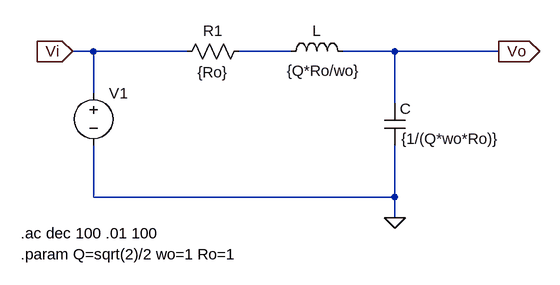
[diagram p0: schematic SOS_pasabajo_simple.asc]
SOS_pasabajo_simple.asc, the LTspice schematic file:
Version 4
SHEET 1 880 680
WIRE -224 112 -256 112
WIRE -80 112 -224 112
WIRE 80 112 0 112
WIRE 240 112 160 112
WIRE 400 112 240 112
WIRE -224 176 -224 112
WIRE 240 192 240 112
WIRE -224 336 -224 256
WIRE 240 336 240 256
WIRE 240 336 -224 336
WIRE 240 368 240 336
FLAG -256 112 Vi
IOPIN -256 112 In
FLAG 400 112 Vo
IOPIN 400 112 Out
FLAG 240 368 0
SYMBOL ind 64 128 R270
WINDOW 0 32 56 VTop 2
WINDOW 3 -29 66 VTop 2
SYMATTR InstName L
SYMATTR Value {Q*Ro/wo}
SYMBOL cap 224 192 R0
WINDOW 3 26 54 Left 2
SYMATTR Value {1/(Q*wo*Ro)}
SYMATTR InstName C
SYMBOL voltage -224 160 R0
WINDOW 3 24 96 Invisible 2
WINDOW 39 0 0 Left 0
SYMATTR Value SINE(0 1 0 0 0 0 1000)
SYMATTR InstName V1
SYMATTR Value2 AC 1 0
SYMBOL res 16 96 R90
WINDOW 0 0 56 VBottom 2
WINDOW 3 32 56 VTop 2
SYMATTR InstName R1
SYMATTR Value {Ro}
TEXT -336 392 Left 2 !.ac dec 100 .01 100
TEXT -336 424 Left 2 !.param Q=sqrt(2)/2 wo=1 Ro=1

The netlist it stands for:
* SOS_pasabajo_simple.asc
L N001 Vo {Q*Ro/wo}
C Vo 0 {1/(Q*wo*Ro)}
V1 Vi 0 SINE(0 1 0 0 0 0 1000) AC 1 0
R1 N001 Vi {Ro}
.ac dec 100 .01 100
.param Q=sqrt(2)/2 wo=1 Ro=1
.backanno
.end